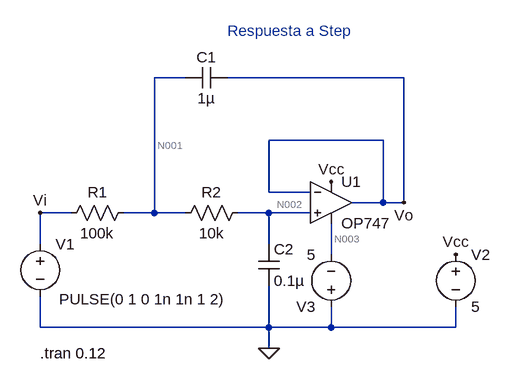
[diagram p0: schematic Step1.asc]
Step1.asc, the LTspice schematic file:
Version 4
SHEET 1 880 680
WIRE 64 -160 16 -160
WIRE 400 -160 128 -160
WIRE 368 -64 192 -64
WIRE 192 16 192 -64
WIRE 256 16 192 16
WIRE 368 32 368 -64
WIRE 368 32 320 32
WIRE 400 32 400 -160
WIRE 400 32 368 32
WIRE -112 48 -160 48
WIRE 16 48 16 -160
WIRE 16 48 -32 48
WIRE 64 48 16 48
WIRE 192 48 144 48
WIRE 256 48 192 48
WIRE -160 96 -160 48
WIRE 192 96 192 48
WIRE 288 112 288 64
WIRE -160 224 -160 176
WIRE 192 224 192 160
WIRE 192 224 -160 224
WIRE 288 224 288 192
WIRE 288 224 192 224
WIRE 480 224 480 192
WIRE 480 224 288 224
WIRE 192 256 192 224
FLAG 192 256 0
FLAG 480 112 Vcc
FLAG 288 0 Vcc
FLAG -160 48 Vi
FLAG 400 32 Vo
SYMBOL cap 176 96 R0
SYMATTR InstName C2
SYMATTR Value 0.1µ
SYMBOL cap 128 -176 R90
WINDOW 0 0 32 VBottom 2
WINDOW 3 32 32 VTop 2
SYMATTR InstName C1
SYMATTR Value 1µ
SYMBOL res -16 32 R90
WINDOW 0 0 56 VBottom 2
WINDOW 3 32 56 VTop 2
SYMATTR InstName R1
SYMATTR Value 100k
SYMBOL res 160 32 R90
WINDOW 0 0 56 VBottom 2
WINDOW 3 32 56 VTop 2
SYMATTR InstName R2
SYMATTR Value 10k
SYMBOL OpAmps\\OP747 288 -32 R0
SYMATTR InstName U1
SYMBOL voltage -160 80 R0
WINDOW 123 31 127 Left 2
WINDOW 39 0 0 Left 0
WINDOW 3 29 101 Left 2
SYMATTR Value PULSE(0 1 0 1n 1n 1 2)
SYMATTR InstName V1
SYMBOL voltage 480 96 R0
WINDOW 123 0 0 Left 0
WINDOW 39 0 0 Left 0
SYMATTR InstName V2
SYMATTR Value 5
SYMBOL voltage 288 208 R180
WINDOW 123 0 0 Left 0
WINDOW 39 0 0 Left 0
SYMATTR InstName V3
SYMATTR Value 5
TEXT -160 264 Left 2 !.tran 0.12
TEXT 128 -232 Left 2 ;Respuesta a Step

The netlist it stands for:
* Step1.asc
C2 N002 0 0.1µ
C1 Vo N001 1µ
R1 N001 Vi 100k
R2 N002 N001 10k
XU1 N002 Vo Vcc N003 Vo OP747  ; pins In+ In- V+ V- OUT
V1 Vi 0 PULSE(0 1 0 1n 1n 1 2)
V2 Vcc 0 5
V3 0 N003 5
.tran 0.12
* Respuesta a Step
.backanno
.end

* Results of the author's LTspice run, read from the files saved beside the schematic
* Operating Point, zero values left out:
*   V(n002) = 1.276 mV
*   V(vo) = 1.356 mV
*   V(n001) = 1.16 mV
*   V(n003) = -5 V
*   V(vcc) = 5 V
*   I(R2) = 11.6 nA
*   I(R1) = 11.6 nA
*   I(V3) = -233.8 µA
*   I(V2) = -233.8 µA
*   I(V1) = 11.6 nA
*   Ix(u1:1) = -11.6 nA
*   Ix(u1:2) = -9.598 nA
*   Ix(u1:99) = 233.8 µA
*   Ix(u1:50) = -233.8 µA
*   Ix(u1:45) = 9.598 nA
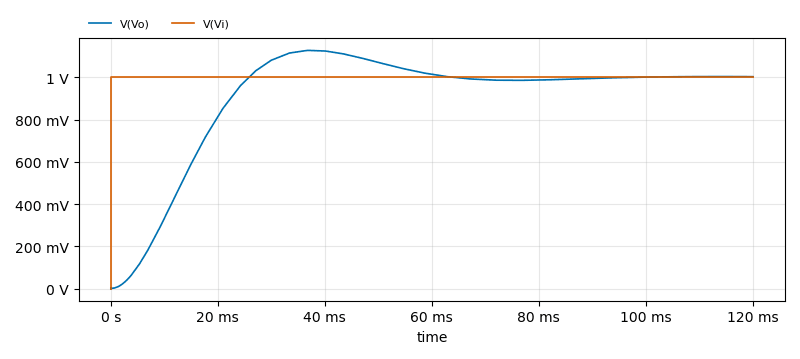
[diagram p1: Transient Analysis of Step1.asc, plotted from the saved traces]
* Transient Analysis, 1 run:
*   V(Vo): min 1.356 mV, max 1.127 V, average 909.3 mV, rms 950 mV, last 1.003 V
*   V(Vi): min 0 V, max 1 V, average 1 V, rms 1 V, last 1 V